# Altium schematic sheet INV.OnGrid-3.6kW.Afore.SchDoc
size 699 x 260 mm
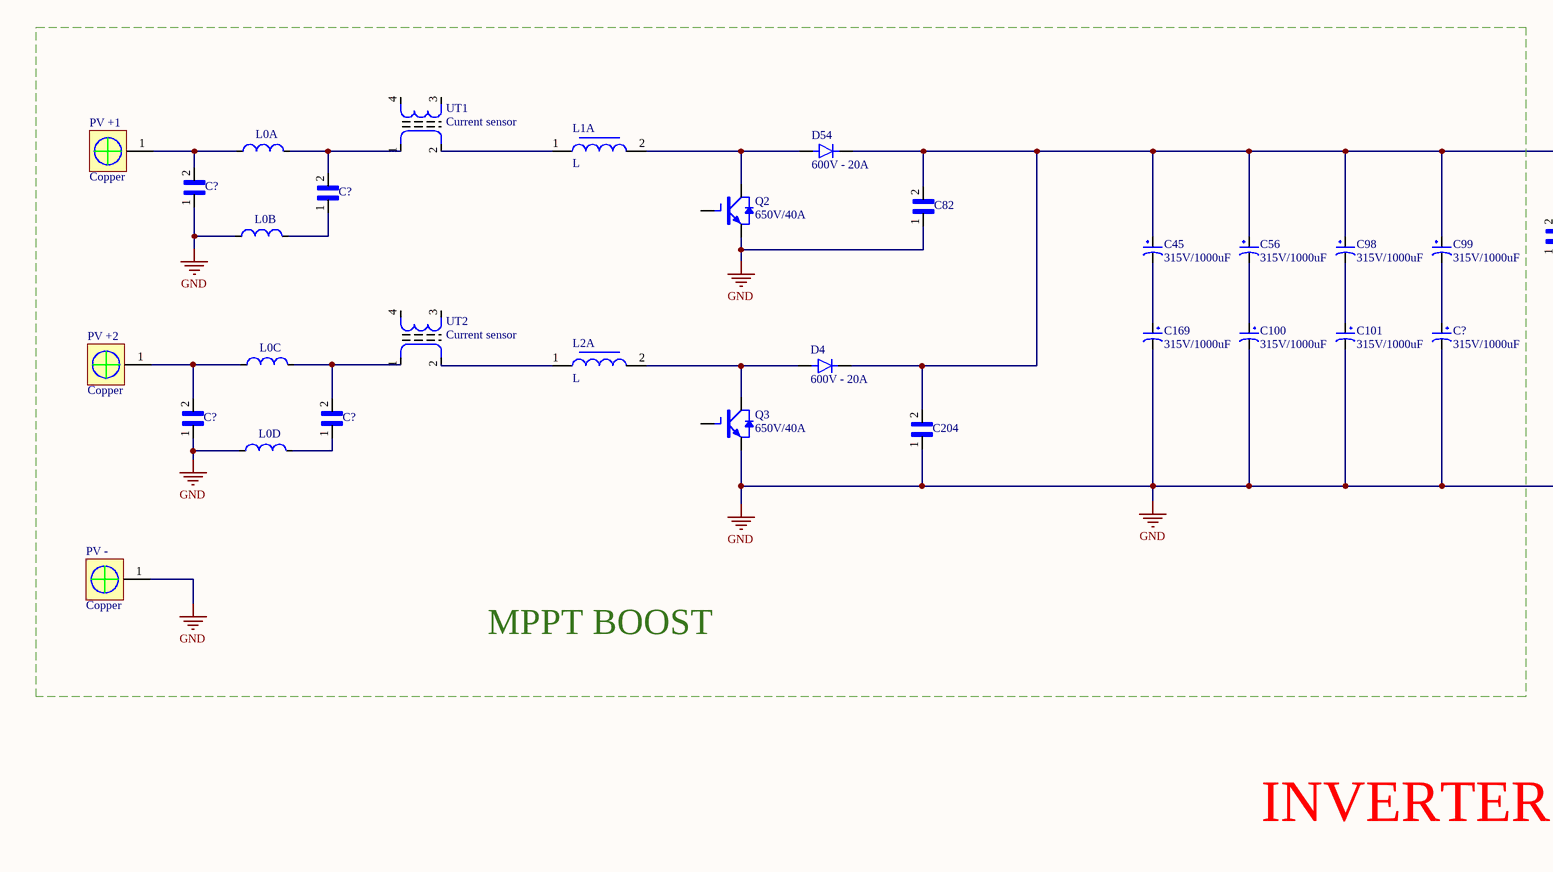
[diagram p0: INV.OnGrid-3.6kW.Afore.SchDoc, left]
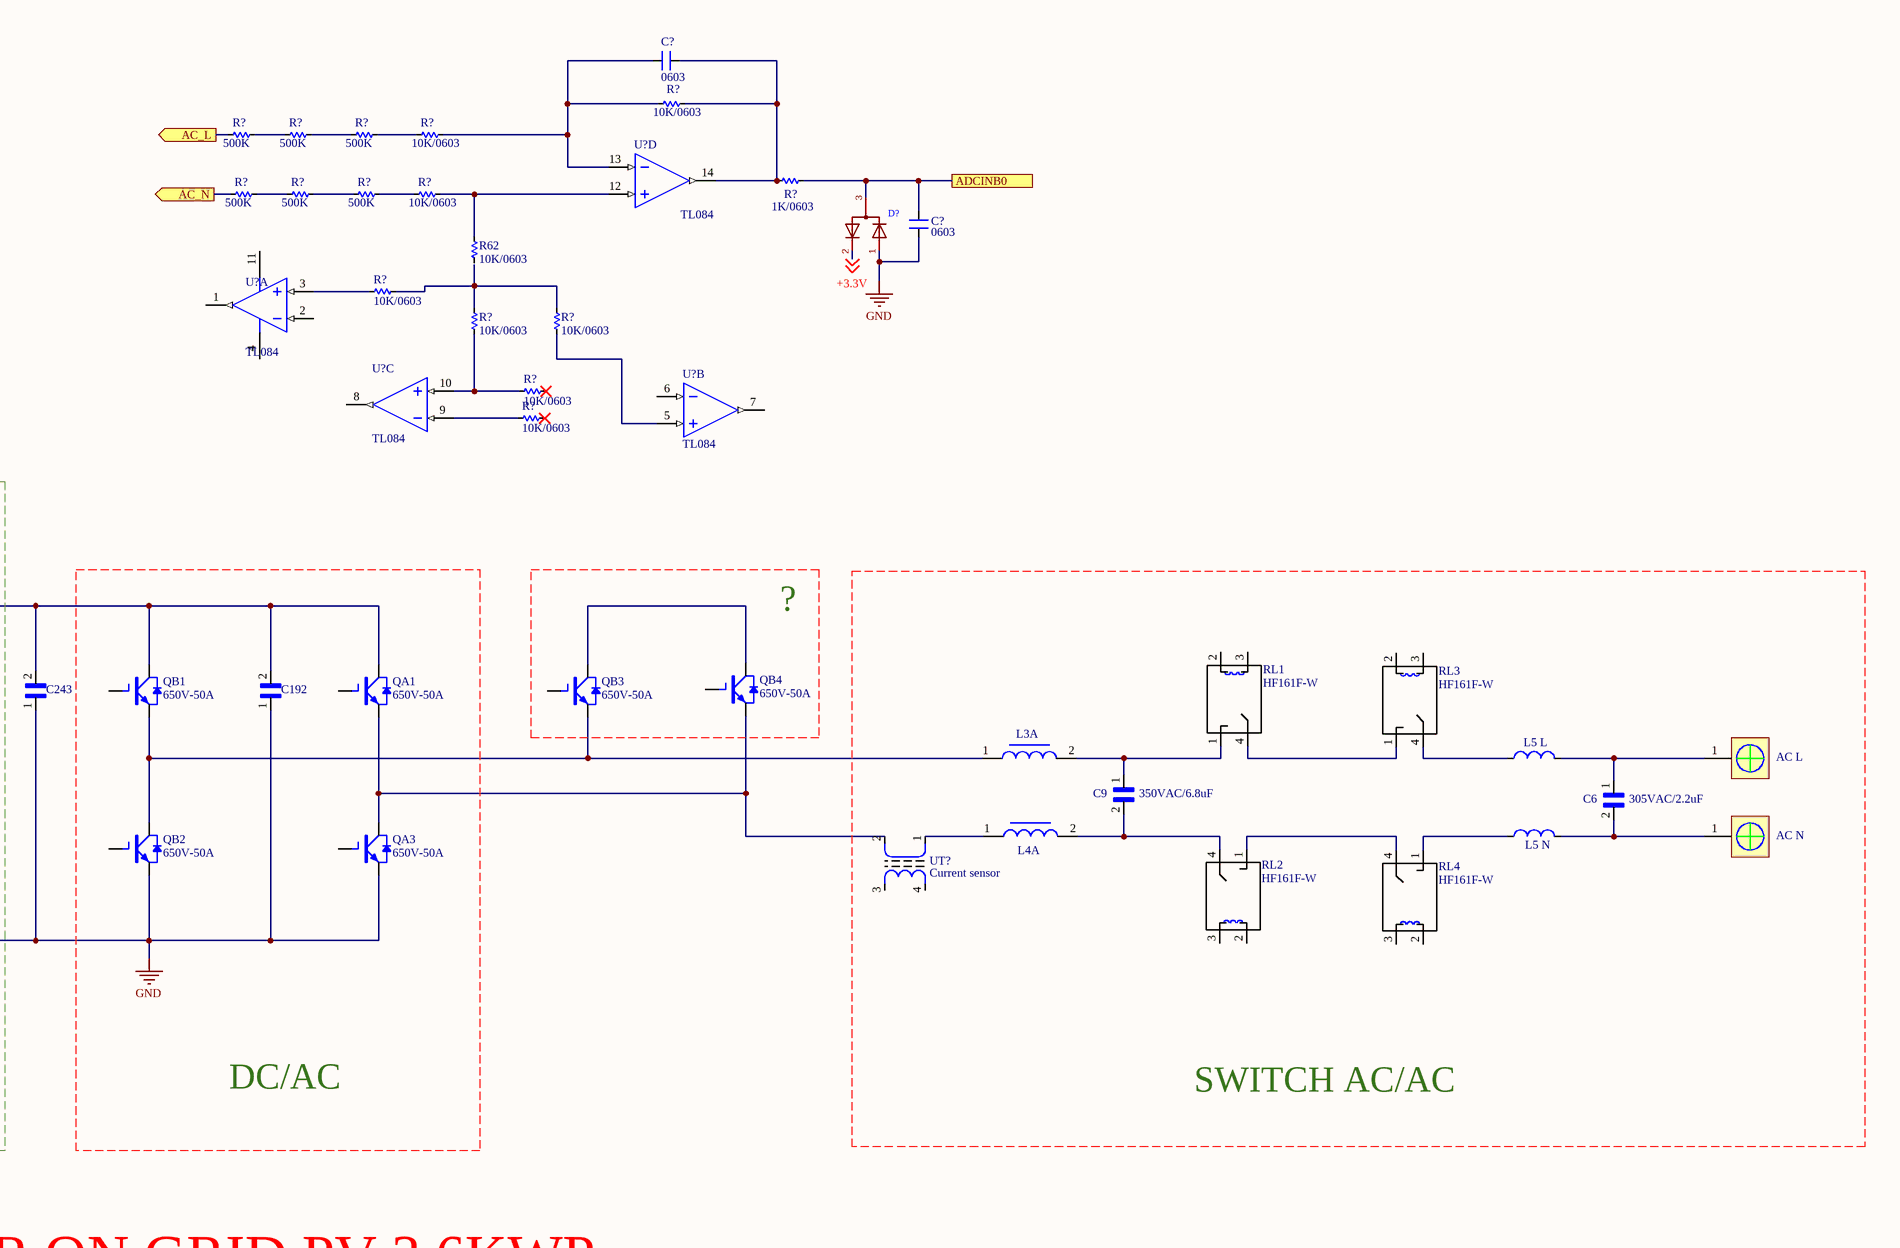
[diagram p1: INV.OnGrid-3.6kW.Afore.SchDoc, right]

## Parts
(Parts that share a designator on the sheet are numbered #1, #2 ... from top to bottom, then left to right.)
*  AC L  [Copper Pipe]
*?  AC N  [Copper Pipe]
C6  305VAC/2.2uF  [CAPRR2250W80L2600T850H1500]
C9  350VAC/6.8uF  [CAPRR2250W80L2600T850H1500]
C45  315V/1000uF  [CAP-10X17-N]
C56  315V/1000uF  [CAP-10X17-N]
C82  (no value)  [CAPRR2250W80L2600T850H1500]
C98  315V/1000uF  [CAP-10X17-N]
C99  315V/1000uF  [CAP-10X17-N]
C100  315V/1000uF  [CAP-10X17-N]
C101  315V/1000uF  [CAP-10X17-N]
C169  315V/1000uF  [CAP-10X17-N]
C192  (no value)  [CAPRR2250W80L2600T850H1500]
C204  (no value)  [CAPRR2250W80L2600T850H1500]
C243  (no value)  [CAPRR2250W80L2600T850H1500]
C?#1  0603  [CAP-SMD-0603]
C?#2  0603  [CAP-SMD-0603]
C?#3  (no value)  [CAPRR2250W80L2600T850H1500]
C?#4  (no value)  [CAPRR2250W80L2600T850H1500]
C?#5  315V/1000uF  [CAP-10X17-N]
C?#6  (no value)  [CAPRR2250W80L2600T850H1500]
C?#7  (no value)  [CAPRR2250W80L2600T850H1500]
D4  600V - 20A  [TO-220AC-2]
D54  600V - 20A  [TO-220AC-2]
D?  Dual-Diode_CA_1  [SOT23-132]  (value not drawn)
L0A  (no value)  [CUON LOC 1010]
L0B  (no value)  [CUON LOC 1010]
L0C  (no value)  [CUON LOC 1010]
L0D  (no value)  [CUON LOC 1010]
L1A  L  [Cuan Cam PWM Hybrid]
L2A  L  [Cuan Cam PWM Hybrid]
L3A  L  [Cuan Cam PWM Hybrid]  (value not drawn)
L4A  L  [Cuan Cam PWM Hybrid]  (value not drawn)
L5_L  150mH  [CUON LOC 1010]  (value not drawn)
L5_N  150mH  [CUON LOC 1010]  (value not drawn)
PV_+1  Copper  [Copper Pipe]
PV_+2  Copper  [Copper Pipe]
PV_-  Copper  [Copper Pipe]
Q2  650V/40A  [TO-3P]
Q3  650V/40A  [TO-3P]
QA1  650V-50A  [TO-3P]
QA3  650V-50A  [TO-3P]
QB1  650V-50A  [TO-3P]
QB2  650V-50A  [TO-3P]
QB3  650V-50A  [TO-3P]
QB4  650V-50A  [TO-3P]
R62  10K/0603  [RES-SMD-0603]
R?#1  10K/0603  [RES-SMD-0603]
R?#2  500K  [RES-SMD-0603]
R?#3  500K  [RES-SMD-0603]
R?#4  500K  [RES-SMD-0603]
R?#5  10K/0603  [RES-SMD-0603]
R?#6  1K/0603  [RES-SMD-0603]
R?#7  500K  [RES-SMD-0603]
R?#8  500K  [RES-SMD-0603]
R?#9  500K  [RES-SMD-0603]
R?#10  10K/0603  [RES-SMD-0603]
R?#11  10K/0603  [RES-SMD-0603]
R?#12  10K/0603  [RES-SMD-0603]
R?#13  10K/0603  [RES-SMD-0603]
R?#14  10K/0603  [RES-SMD-0603]
R?#15  10K/0603  [RES-SMD-0603]
RL1  HF161F-W  [RELAY 10A/250V]
RL2  HF161F-W  [RELAY 10A/250V]
RL3  HF161F-W  [RELAY 10A/250V]
RL4  HF161F-W  [RELAY 10A/250V]
U?#1  TL084  [SO14]  (part D of 4)
U?#2  TL084  [SO14]  (part A of 4)
U?#3  TL084  [SO14]  (part B of 4)
U?#4  TL084  [SO14]  (part C of 4)
UT1  Current sensor  [Bien ap do Current]
UT2  Current sensor  [Bien ap do Current]
UT?  Current sensor  [Bien ap do Current]

## Ports
AC_L (out, see INV.CTL.V1[1D]), AC_N (out, see INV.CTL.V1[1D]), ADCINB0 (see INV.CTL.V1[1A])

## Nets
GND: C82.1 C100.2 C101.2 C169.2 C192.1 C204.1 C243.1 C?#2.1 C?#3.1 C?#5.2 C?#6.1 D?.1(C) L0B.1 L0D.1 PV_-.1 Q2.3(E) Q3.3(E) QA3.3(E) QB2.3(E)
+3.3V: D?.2(C) ; off-sheet +3.3V
AC_L: R?#2.1 ; port AC_L
AC_N: R?#7.1 ; port AC_N
ADCINB0: C?#2.2 D?.3(A) R?#6.2 ; port ADCINB0
Net*?_1: *?.1 C6.2 L5_N.2
Net*_1: *.1 C6.1 L5_L.2
NetC9_1: C9.1 L3A.2 RL1.1
NetC9_2: C9.2 L4A.2 RL2.4
NetC45_1: C45.1 C56.1 C82.2 C98.1 C99.1 C192.2 C204.2 C243.2 D4.1(K) D54.1(K) QA1.2(C) QB1.2(C)
NetC45_2: C45.2 C169.1
NetC56_2: C56.2 C100.1
NetC98_2: C98.2 C101.1
NetC99_2: C99.2 C?#5.1
NetC?#1_1: C?#1.1 R?#1.2 R?#6.1 U?#1.14(4_OUT)
NetC?#1_2: C?#1.2 R?#1.1 R?#5.2 U?#1.13(4_IN-)
NetC?#3_2: C?#3.2 L0A.1 PV_+1.1
NetC?#4_1: C?#4.1 L0B.2
NetC?#4_2: C?#4.2 L0A.2 UT1.1
NetC?#6_2: C?#6.2 L0C.1 PV_+2.1
NetC?#7_1: C?#7.1 L0D.2
NetC?#7_2: C?#7.2 L0C.2 UT2.1
NetD4_3: D4.3(A) L2A.2 Q3.2(C)
NetD54_3: D54.3(A) L1A.2 Q2.2(C)
NetL1A_1: L1A.1 UT1.2
NetL2A_1: L2A.1 UT2.2
NetL3A_1: L3A.1 QB1.3(E) QB2.2(C) QB3.3(E)
NetL4A_1: L4A.1 UT?.1
NetL5_L_1: L5_L.1 RL3.4
NetL5_N_1: L5_N.1 RL4.1
NetQA1_3: QA1.3(E) QA3.2(C) QB4.3(E) UT?.2
NetQB3_2: QB3.2(C) QB4.2(C)
NetR62_1: R62.1 R?#10.2 U?#1.12(4_IN+)
NetR?#2_2: R?#2.2 R?#3.1
NetR?#3_2: R?#3.2 R?#4.1
NetR?#4_2: R?#4.2 R?#5.1
NetR?#7_2: R?#7.2 R?#8.1
NetR?#8_2: R?#8.2 R?#9.1
NetR?#9_2: R?#9.2 R?#10.1
NetR?#11_1: R?#11.1 U?#2.3(1_IN+)
NetR?#11_2: R?#11.2 R?#12.1 R?#13.1
NetR?#12_2: R?#12.2 R?#14.1 U?#4.10(3_IN+)
NetR?#13_2: R?#13.2 U?#3.5(2_IN+)
NetR?#15_1: R?#15.1 U?#4.9(3_IN-)
NetRL1_4: RL1.4 RL3.1
NetRL2_1: RL2.1 RL4.4

Not connected (* = marked no-connect by the designer): Q2 1(G); Q3 1(G); QA1 1(G); QA3 1(G); QB1 1(G); QB2 1(G); QB3 1(G); QB4 1(G); R62 2; R?#14 2*; R?#15 2*; RL1 2 3; RL2 2 3; RL3 2 3; RL4 2 3; U?#2 1(1_OUT) 2(1_IN-) 4(VCC) 11(VEE); U?#3 6(2_IN-) 7(2_OUT); U?#4 8(3_OUT); UT1 3 4; UT2 3 4; UT? 3 4

## Notes on the sheet
- ?
- MPPT BOOST
- DC/AC
- SWITCH AC/AC
- INVERTER ON GRID PV 3.6KWP

## Library data of the parts
* *? = Copper
C6 C9 C82 C192 C204 C243 C?#3 C?#4 C?#6 C?#7 = ECWFG2J475KA: Metallized Polypropylene Film Capacitor; MF: Panasonic; Value: *; Price: None; Package: MOLDED-2 Panasonic; MP: ECWFG2J475KA; Availability: In Stock; Check_prices: https://www.snapeda.com/parts/ECWFG2J475KA/Panasonic/view-part/?ref=eda; SnapEDA_Link: https://www.snapeda.com/parts/ECWFG2J475KA/Panasonic/view-part/?ref=snap
C45 C56 C98-C101 C169 C?#5 = Cap - 10x18 - N: Cắm; Don_Vi: Con; So_Chan: 2; Ten_Linh_Kien: Tụ Hóa 220uF 10V 6x11MM; Ma_Hang: MH004510; Chung_Loai: Cắm; Kieu_Chan: *
C?#1 C?#2 = CAP-SMD: Value: 33pF
D4 = MUR1560: 600V-20A - B2D20065H BASIC; MF: ON Semiconductor; Arrow_Electronics-Purchase-URL: https://snapeda.com/shop?store=Arrow+Electronics&id=621574; Value: *; SnapEDA_Link: https://www.snapeda.com/parts/MUR1560/ON%20Semiconductor/view-part/621574/?ref=snap; Package: TO-220 ON Semiconductor; MP: MUR1560
D54 = MUR1560: 600V-20A - B2D20065H; MF: ON Semiconductor; Arrow_Electronics-Purchase-URL: https://snapeda.com/shop?store=Arrow+Electronics&id=621574; Value: *; SnapEDA_Link: https://www.snapeda.com/parts/MUR1560/ON%20Semiconductor/view-part/621574/?ref=snap; Package: TO-220 ON Semiconductor; MP: MUR1560
D? = Dual-Diode_CA_1: BAT54S(D88) thay the BAV99:A7; ki_keywords: Dual Diode Common Anode; Value: Dual_Diode_CA; Reference: D; ki_description: Dual Diode Common Anode
L0A L0B L0C L0D = L1: Inductor; Value: 150 mH
L1A L2A L3A L4A = CUON CAM PWM Hybrid: Cuận cảm bộ sạc PWM Hybrid; Value: Loc 220; Designed by: VanDungEvn
L5_L L5_N = L1: Inductor; Value: 150 mH
Q2 Q3 = FGA25N120ANTD: G40H65DFB ST; MF: ON Semiconductor; Value: *; Digi-Key_Purchase_URL: https://www.digikey.in/product-detail/en/on-semiconductor/FGA25N120ANTDTU/FGA25N120ANTDTU-ND/820640?utm_source=snapeda&utm_medium=aggregator&utm_campaign=symbol; MP: FGA25N120ANTD; Package: TO-3 Fairchild Semiconductor; SnapEDA_Link: https://www.snapeda.com/parts/FGA25N120ANTD/ON%20Semiconductor/view-part/202622/?ref=snap; Digi-Key_Part_Number: FGA25N120ANTDTU-ND
QA1 QA3 QB1-QB4 = FGA25N120ANTD: 650V-50A-K50EET7; MF: ON Semiconductor; Value: *; Digi-Key_Purchase_URL: https://www.digikey.in/product-detail/en/on-semiconductor/FGA25N120ANTDTU/FGA25N120ANTDTU-ND/820640?utm_source=snapeda&utm_medium=aggregator&utm_campaign=symbol; MP: FGA25N120ANTD; Package: TO-3 Fairchild Semiconductor; SnapEDA_Link: https://www.snapeda.com/parts/FGA25N120ANTD/ON%20Semiconductor/view-part/202622/?ref=snap; Digi-Key_Part_Number: FGA25N120ANTDTU-ND
R62 R?#1-R?#15 = Res-SMD: Resistor; Manufacturer: Generic Components; Class: Passive; Published: 08/06/2000; Publisher: Altium Hobart Technology Centre
RL1-RL4 = RELAY 10A/250V-SY
U?#1-U?#4 = LF347: Low Power Quad Operational Amplifier; Manufacturer Part Number: LF347BD; Manufacturer: Texas Instruments; Text Field1: pristel=Nsc\nsanopea\<parttype>.ckt; Slew Rate: 13 V/µs; Voltage - Supply, Single/Dual (±): 7 V ~ 36 V, ±3.5 V ~ 18 V; Current - Input Bias: 50pA; Voltage - Input Offset: 3000µV; Number of Circuits: 4; Gain Bandwidth Product: 3MHz; Amplifier Type: J-FET; Current - Supply: 8mA; Supplier 1: Digi-Key; Supplier Part Number 1: 296-7136-5-ND; Package / Case: 14-SOIC (3.9mm Width), 14-SOL; Supplier: Digi-Key; Current - Output / Channel: -; Packaging: Tube; RoHS: RoHS Compliant; Output Type: -; Operating Temperature: 0°C ~ 70°C; Category: Integrated Circuits (ICs); Supplier Part Number: 296-7136-5-ND
UT1 UT2 UT? = Bien ap dong: Biến áp đo dòng; Value: Loc 220; Designed by: VanDungEvn